# EAGLE design Adafruit Circuit Playground (EAGLE 6.6.0)
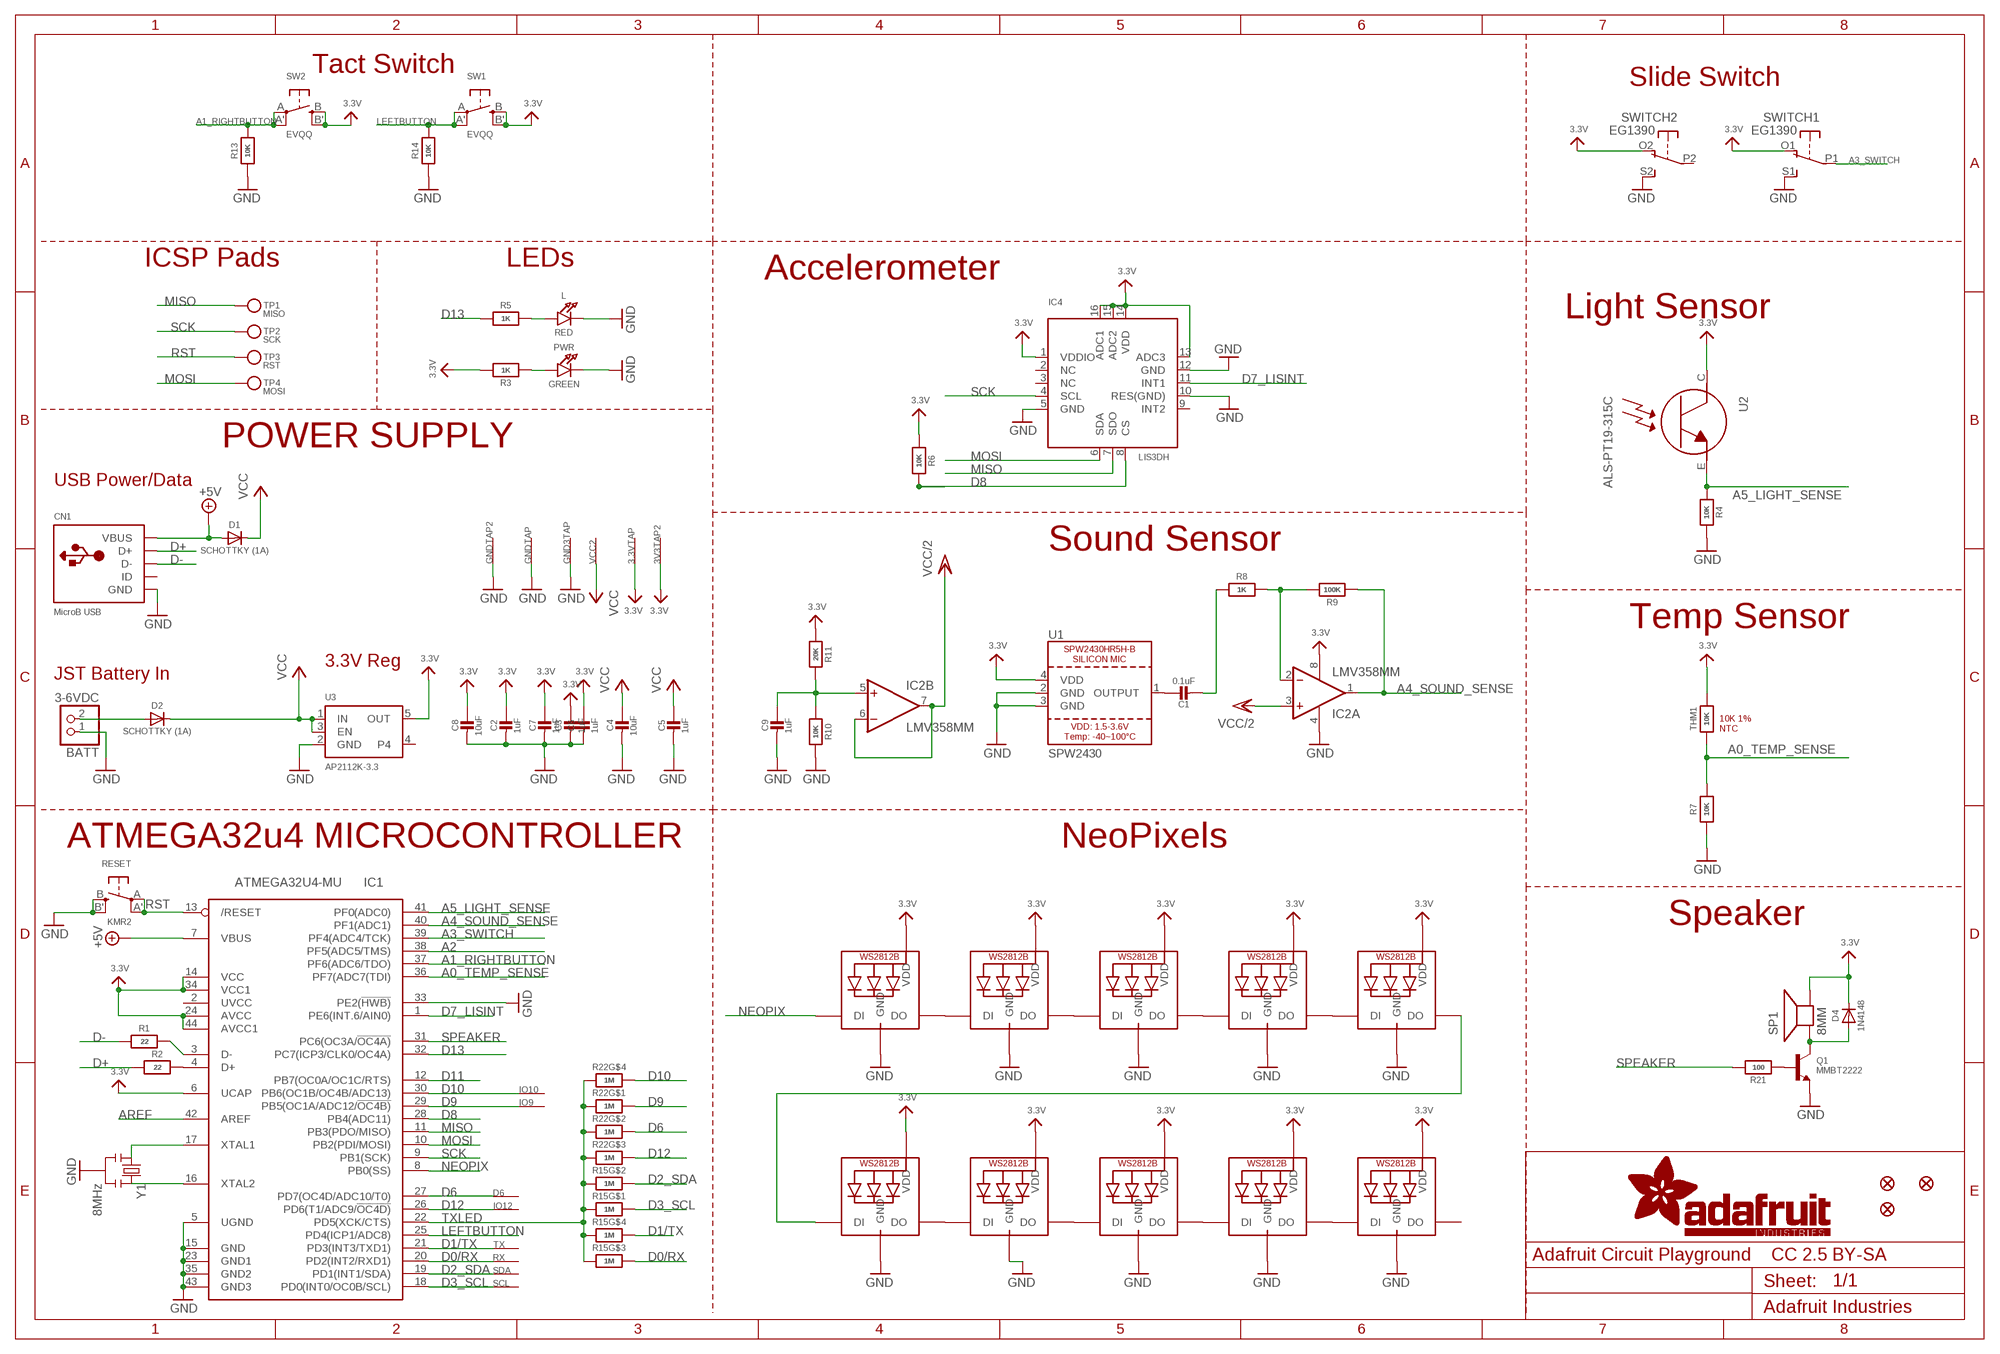
[diagram p0: schematic, sheet 1]

## Parts
3.3VTAP  SEWTAP-ALLIGATOR  [SEWALLI]
3V3TAP2  SEWTAP-ALLIGATOR  [SEWALLI]
BATT  3-6VDC  CON_JST_PH_2PIN  [JSTPH2]
C1  0.1uF  CAP_CERAMIC0603_NO  [0603-NO]
C2  1uF  CAP_CERAMIC0603_NO  [0603-NO]
C3  1uF  CAP_CERAMIC0603_NO  [0603-NO]
C4  10uF  CAP_CERAMIC0805-NOOUTLINE  [0805-NO]
C5  1uF  CAP_CERAMIC0603_NO  [0603-NO]
C6  1uF  CAP_CERAMIC0603_NO  [0603-NO]
C7  1uF  CAP_CERAMIC0603_NO  [0603-NO]
C8  10uF  CAP_CERAMIC0805-NOOUTLINE  [0805-NO]
C9  1uF  CAP_CERAMIC0603_NO  [0603-NO]
CN1  MicroB USB  USB_MICRO_20329_V2  [4UCONN_20329_V2]
D1  SCHOTTKY (1A)  DIODESOD-123  [SOD-123]
D2  SCHOTTKY (1A)  DIODESOD-123  [SOD-123]
D4  1N4148  DIODESOD-323  [SOD-323]
D6  SEWTAP-ALLIGATOR  [SEWALLI]
GND3TAP  SEWTAP-ALLIGATOR  [SEWALLI]
GNDTAP  SEWTAP-ALLIGATOR  [SEWALLI]
GNDTAP2  SEWTAP-ALLIGATOR  [SEWALLI]
IC1  ATMEGA32U4-MU  [TQFN44_7MM]
IC2  LMV358MM  [MSOP08]
IC4  LIS3DH  ACCEL_LIS3DHTR  [LGA16_3X3MM]
IO9  SEWTAP-ALLIGATOR  [SEWALLI]
IO10  SEWTAP-ALLIGATOR  [SEWALLI]
IO12  SEWTAP-ALLIGATOR  [SEWALLI]
L  RED  LED0805_NOOUTLINE  [CHIPLED_0805_NOOUTLINE]
LED1  WS2812B3535  [LED3535]
LED2  WS2812B3535  [LED3535]
LED3  WS2812B3535  [LED3535]
LED4  WS2812B3535  [LED3535]
LED5  WS2812B3535  [LED3535]
LED6  WS2812B3535  [LED3535]
LED7  WS2812B3535  [LED3535]
LED8  WS2812B3535  [LED3535]
LED9  WS2812B3535  [LED3535]
LED10  WS2812B3535  [LED3535]
PWR  GREEN  LED0805_NOOUTLINE  [CHIPLED_0805_NOOUTLINE]
Q1  MMBT2222  TRANSISTOR_NPNWIDE  [SOT23-WIDE]
R1  22  RESISTOR_0603_NOOUT  [0603-NO]
R2  22  RESISTOR_0603_NOOUT  [0603-NO]
R3  1K  RESISTOR_0603_NOOUT  [0603-NO]
R4  10K  RESISTOR_0603_NOOUT  [0603-NO]
R5  1K  RESISTOR_0603_NOOUT  [0603-NO]
R6  10K  RESISTOR_0603_NOOUT  [0603-NO]
R7  10K  RESISTOR_0603_NOOUT  [0603-NO]
R8  1K  RESISTOR_0603_NOOUT  [0603-NO]
R9  100K  RESISTOR_0603_NOOUT  [0603-NO]
R10  10K  RESISTOR_0603_NOOUT  [0603-NO]
R11  20K  RESISTOR_0603_NOOUT  [0603-NO]
R13  10K  RESISTOR_0603_NOOUT  [0603-NO]
R14  10K  RESISTOR_0603_NOOUT  [0603-NO]
R15  1M  RESISTOR_4PACK_NO  [RESPACK_4X0603_NO]
R21  100  RESISTOR_0603_NOOUT  [0603-NO]
R22  1M  RESISTOR_4PACK_NO  [RESPACK_4X0603_NO]
RESET  KMR2  SWITCH_TACT_SMT4.6X2.8  [BTN_KMR2_4.6X2.8]
RX  SEWTAP-ALLIGATOR  [SEWALLI]
SCL  SEWTAP-ALLIGATOR  [SEWALLI]
SDA  SEWTAP-ALLIGATOR  [SEWALLI]
SP1  8MM  SPEAKER_BUZZER5MM  [BUZZER_SMT_5MM]
SW1  EVQQ  SWITCH_TACT_SMT_EVQQ2_SMALL  [EVQ-Q2_SMALLER]
SW2  EVQQ  SWITCH_TACT_SMT_EVQQ2_SMALL  [EVQ-Q2_SMALLER]
SWITCH  EG1390  DPDT-EG1390  [EG1390]
THM1  10K  RESISTOR_0402  [_0402]
TP1  MISO  TESTPOINTROUND1.5MM  [TESTPOINT_ROUND_1.5MM]
TP2  SCK  TESTPOINTROUND1.5MM  [TESTPOINT_ROUND_1.5MM]
TP3  RST  TESTPOINTROUND1.5MM  [TESTPOINT_ROUND_1.5MM]
TP4  MOSI  TESTPOINTROUND1.5MM  [TESTPOINT_ROUND_1.5MM]
TX  SEWTAP-ALLIGATOR  [SEWALLI]
U1  SPW2430  SPW2430HR5H-B  [SPW2430HR5H-B]
U2  ALS-PT19-315C  LIGHT_ALS-PT19-315C  [ALS-PT19-315C]
U3  AP2112K-3.3  VREG_SOT23-5  [SOT23-5]
U$2  FIDUCIAL""  [FIDUCIAL_1MM]
U$3  FIDUCIAL""  [FIDUCIAL_1MM]
U$6  FIDUCIAL""  [FIDUCIAL_1MM]
VCC2  SEWTAP-ALLIGATOR  [SEWALLI]
Y1  8MHz  RESONATORSMD  [RESONATOR-SMD]

## Nets
3.3V: 3.3VTAP.P$1(SEW) 3V3TAP2.P$1(SEW) C2.1 C3.1 C6.1 C7.1 C8.1 D4.C IC1.6(UCAP) IC1.14(VCC) IC1.24(AVCC) IC1.34(VCC1) IC1.44(AVCC1) IC2.8(P:V+) IC4.1(VDDIO) IC4.13(ADC3) IC4.14(VDD) IC4.15(ADC2) IC4.16(ADC1) LED1.2(VDD) LED2.2(VDD) LED3.2(VDD) LED4.2(VDD) LED5.2(VDD) LED6.2(VDD) LED7.2(VDD) LED8.2(VDD) LED9.2(VDD) LED10.2(VDD) R3.2 R6.1 R11.1 SP1.- SW1.B'(S1) SW1.B(S) SW2.B'(S1) SW2.B(S) SWITCH.O1(1:O) SWITCH.O2(2:O) THM1.2 U1.4(VDD) U2.C U3.5(OUT)
+5V: CN1.VBUS D1.A IC1.7(VBUS)
A0_TEMP_SENSE: IC1.36(PF7(ADC7(TDI)) R7.2 THM1.1
A1_RIGHTBUTTON: IC1.37(PF6(ADC6/TDO)) R13.2 SW2.A'(P1) SW2.A(P)
A2: IC1.38(PF5(ADC5/TMS))
A3_SWITCH: IC1.39(PF4(ADC4/TCK)) SWITCH.P1(1:P)
A4_SOUND_SENSE: IC1.40(PF1(ADC1)) IC2.1(A:OUT) R9.1
A5_LIGHT_SENSE: IC1.41(PF0(ADC0)) R4.2 U2.E
AREF: IC1.42(AREF)
D0/RX: IC1.20(PD2(INT2/RXD1)) R15.6 RX.P$1(SEW)
D1/TX: IC1.21(PD3(INT3/TXD1)) R15.5 TX.P$1(SEW)
D2_SDA: IC1.19(PD1(INT1/SDA)) R15.7 SDA.P$1(SEW)
D3_SCL: IC1.18(PD0(INT0/OC0B/SCL)) R15.8 SCL.P$1(SEW)
D6: D6.P$1(SEW) IC1.27(PD7(OC4D/ADC10/T0)) R22.7
D7_LISINT: IC1.1(PE6(INT.6/AIN0)) IC4.11(INT1)
D8: IC1.28(PB4(ADC11)) IC4.8(CS) R6.2
D9: IC1.29(PB5(OC1A/ADC12/!OC4B)) IO9.P$1(SEW) R22.8
D10: IC1.30(PB6(OC1B/OC4B/ADC13)) IO10.P$1(SEW) R22.5
D11: IC1.12(PB7(OC0A/OC1C/RTS))
D12: IC1.26(PD6(T1/ADC9/!OC4D)) IO12.P$1(SEW) R22.6
D13: IC1.32(PC7(ICP3/CLK0/OC4A)) R5.1
D+: CN1.D+ R2.1
D-: CN1.D- R1.1
GND: BATT.1 C2.2 C3.2 C4.2 C5.2 C6.2 C7.2 C8.2 C9.2 CN1.BASE@1(GND) CN1.BASE@2(GND) CN1.GND CN1.SPRT@1(GND) CN1.SPRT@2(GND) CN1.SPRT@3(GND) CN1.SPRT@4(GND) GND3TAP.P$1(SEW) GNDTAP2.P$1(SEW) GNDTAP.P$1(SEW) IC1.5(UGND) IC1.15(GND) IC1.23(GND1) IC1.33(PE2(!HWB)) IC1.35(GND2) IC1.43(GND3) IC2.4(P:V-) IC4.5(GND) IC4.10(RES(GND)) IC4.12(GND) L.C LED1.4(GND) LED2.4(GND) LED3.4(GND) LED4.4(GND) LED5.4(GND) LED6.4(GND) LED7.4(GND) LED8.4(GND) LED9.4(GND) LED10.4(GND) PWR.C Q1.2(E) R4.1 R7.1 R10.2 R13.1 R14.1 RESET.B'(S1) RESET.B(S) SWITCH.S1(1:S) SWITCH.S2(2:S) U1.2(GND) U1.3(GND) U3.2(GND) Y1.2
LEFTBUTTON: IC1.25(PD4(ICP1/ADC8)) R14.2 SW1.A'(P1) SW1.A(P)
MISO: IC1.11(PB3(PDO/MISO)) IC4.7(SDO) TP1.P$1
MOSI: IC1.10(PB2(PDI/MOSI)) IC4.6(SDA) TP4.P$1
N$1: PWR.A R3.1
N$2: IC2.2(A:-IN) R8.2 R9.2
N$3: IC1.3(D-) R1.2
N$4: IC1.4(D+) R2.2
N$6: C9.1 IC2.5(B:+IN) R10.1 R11.2
N$7: BATT.2 D2.A
N$8: IC1.17(XTAL1) Y1.1
N$9: IC1.16(XTAL2) Y1.3
N$10: L.A R5.2
N$11: LED1.1(DI) LED2.3(DO)
N$12: LED1.3(DO) LED3.1(DI)
N$13: LED2.1(DI) LED10.3(DO)
N$14: LED6.3(DO) LED7.1(DI)
N$15: C1.2 R8.1
N$16: LED7.3(DO) LED8.1(DI)
N$17: LED8.3(DO) LED9.1(DI)
N$18: LED9.3(DO) LED10.1(DI)
N$19: LED3.3(DO) LED4.1(DI)
N$20: LED4.3(DO) LED5.1(DI)
N$24: D4.A Q1.3(C) SP1.+
N$25: Q1.1(B) R21.1
NEOPIX: IC1.8(PB0(SS)) LED6.1(DI)
RST: IC1.13(/RESET) RESET.A'(P1) RESET.A(P) TP3.P$1
SCK: IC1.9(PB1(SCK)) IC4.4(SCL) TP2.P$1
SOUNDOUT: C1.1 U1.1(OUTPUT)
SPEAKER: IC1.31(PC6(OC3A/!OC4A)) R21.2
TXLED: IC1.22(PD5(XCK/CTS)) R15.1 R15.2 R15.3 R15.4 R22.1 R22.2 R22.3 R22.4
VCC: C4.1 C5.1 D1.C D2.C U3.1(IN) U3.3(EN) VCC2.P$1(SEW)
VCC/2: IC2.3(A:+IN) IC2.6(B:-IN) IC2.7(B:OUT)
Unconnected: CN1.ID IC1.2(UVCC) IC4.2(NC) IC4.3(NC) IC4.9(INT2) LED5.3(DO) SWITCH.P2(2:P) U3.4

## Notes on the sheet
- Tact Switch
- Slide Switch
- ICSP Pads | LEDs
- Accelerometer
- Light Sensor
- POWER SUPPLY
- USB Power/Data
- Sound Sensor
- Temp Sensor
- 3.3V Reg
- JST Battery In
- 10K 1%
  NTC
- ATMEGA32u4 MICROCONTROLLER | NeoPixels
- Speaker
- CC 2.5 BY-SA

## Library data of the parts
3.3VTAP 3V3TAP2 D6 GND3TAP GNDTAP GNDTAP2 IO9 IO10 IO12 RX SCL SDA TX VCC2 = microbuilder:SEWTAP
BATT = microbuilder:CON_JST_PH_2PIN: JST 2-Pin Right-Angle Connector PH-Series - 4UConnector: 17311 SH-Series - 4UConnector: 07278
C1-C9 = microbuilder:CAP_CERAMIC: Ceramic Capacitors For new designs, use the packages preceded by an '_' character since they are more reliable: The following footprints should be used on most boards: _0402 - Standard footprint for regular board layouts _0603 - Standard footprint for regular board layouts _0805 - Standard footprint for regular board layouts _1206 - Standard footprint for regular board layouts For extremely tight-pitch boards where space is at a premium, the following 'micro-pitch' footprints can be used (smaller pads, no silkscreen outline, etc.): _0402MP - Micro-pitch footprint for very dense/compact boards _0603MP - Micro-pitch footprint for very dense/compact boards _0805MP - Micro-pitch footprint for very dense/compact boards _1206MP - Micro-pitch footprint for very dense/compact boards
CN1 = microbuilder:USB: USB Connectors USBMINIB - Surface Mount Female Mini-B USB Connector 4UConnector: 06564
D1 D2 D4 = microbuilder:DIODE: Diode SMA Model Volts Amps Type Vf Ir Digikey # Notes SSA34-E3 40V 3A Schottky 480mV @ 3A 200uA @ 40V SSA34-E3/61TGITR-ND CDBA120-G 20V 1A Schottky 500mV @ 1A 500uA @ 20V 641-1014-6-ND REEL MBRA210 10V 2A Schottky 350mV @ 2A 700uA @ 10V MBRA210LT3 SOD-123 Model Volts Amps Type Vf Ir Order # Notes BAT54T1G 30V 200mA Schottky 800mV @ 200mA 2uA @ 25V BAT54T1GOSTR-ND B0530W 30V 500mA Schottky 430mV @ 500mA 130uA @ 30V B0530W-FDICT-ND REEL MBR120 20V 1A Schottky 340mV @ 1A MBR120VLSFT1GOSCT-ND SOD-323 Model Volts Amps Type Vf Ir Order # Notes PMEG2005EJ 20V 500mA Schottky 355mV @ 500mA 568-4110-1-ND ZLLS410 10V 570mA Schottky 380mV @ 570mA ZLLS410CT-ND 1N4148WS 75V 150mA Silicon/Simple 1V 1N4148WSFSCT-ND REEL SOD-523 Model Volts Amps Type Vf Ir Order # Notes BAT54XV2 30V 200mA Schottky 0.8V @ 100mA BAT54XV2CT-ND TB751S 30V 30mA Schottky RB751S-40TE61CT-ND SOT23-R/W (R = Solder Paste/Reflow Ovens, W = Hand-Soldering) Model Volts Amps Type Vf Ir Order # Notes BAT54FILM 40V 300mA Schottky 497-7162-1-ND POWERDI-5 Model Volts Amps Type Vf Ir Order # Notes PDS560 60V 5A Schottky 670mV @ 5A 150uA @ 60V PDS560DICT-ND
IC1 = microbuilder:ATMEGA32U4: http://www.ladyada.net/library/eagle
IC2 = linear:LMV358?*: Dual General Purpose, Low Voltage, Rail-to-Rail Output Operational Amplifiers Source: http://www.national.com/mpf/LM/LMV321.html http://www.national.com/dt/lmv_qual.pdf
IC4 = microbuilder:ACCEL_LIS3DHTR: LIS3DHTR 3-Axis Accelerometer with I2C/SPI Interface VDD: 1.71-3.6V VDDIO: 1.71-VDD+0.1V Scale: +/-2g, 4g, 8g, 16g with 16--bit data output Temp:: -40°C - 85°C Mouser: 511-LIS3DHTR Digikey: 497-10613-1-ND
L PWR = microbuilder:LED: LED 0603 - 0603 Surface Mount Package 2mA: Green LED - Low Power (3.9mcd, 2ma, 1.7Vf) - Digikey: 475-2709-2-ND Orange LED - Low Power (9.8mcd, 2ma, 1.8Vf) - Digikey: 475-1194-2-ND Red LED - Low Power (5mcd, 2ma, 1.8Vf) - Digikey: 475-1195-2-ND Yellow LED - Low Power (7mcd, 2ma, 1.8Vf) - Digikey: 475-1196-2-ND 5mA: Blue LED - Low Power (17mcd, 5ma, 2.9Vf) - Digikey: LNJ937W8CRACT-ND 0805 - 0805 Surface Mount Package 2mA: Red LED (8.8mcd, 2mA, 1.8Vf, Clear) - Low Power [Digikey: 475-2510-1-ND] Green LED (5mcd, 2mA, 1.8Vf, Clear) - Low Power [Digikey: 475-2730-1-ND] Yellow LED (11.3mcd, 2mA, 1.8Vf, Clear) - Low Power [Digikey: 475-2555-1-ND] 20mA: Red LED (104mcd, 20mA, Diffused) - LS R976 [Digikey: 475-1278-6-ND] Red LED (12mcd, 20mA, 2.0Vf, Clear) - APT2012EC [Digikey: 754-1128-1-ND] Green LED (15mcd, 20mA, 2.2Vf, Clear) - APT2012GC [Digikey: 754-1131-1-ND] Orange LED (160mcd, 20mA, 2.1Vf, Clear) - APT2012SECK [Digikey: 754-1130-1-ND] 1206 - 1206 Surface Mount Package Green LED (26mcd, 20mA, Diffused) - LG N971 [Digikey: 475-1407-6-ND] Red LED (15mcd, 20mA, Diffused) - LH N974 [Digikey: 475-1416-6-ND] Cree - Cree High-Power Surface Mount LEDs XPEBWT-L1-0000-00D50 - White 111lm 350mA 2.9Vf 6200K 110° XTEAWT-00-0000-00000LEE3 - White 114lm 350mA 2.85Vf 5000K 115° Everlight - Everlight 45-21 Series Surface Mount LEDs 45-21/QK2C-B2832AC2CB2/2T - Warm White 2000mcd 20mA 3.25Vf 3050K 120° 45-21/LK2C-B38452C4CB2/2T - Nuetral White 2000mcd 20mA 3.25Vf 4150K 120° 45-21/LK2C-B50634C6CB2/2T - Cold White 2200mcd 20mA 3.25Vf 5650K 120° PLCC2 Reverse Mount LS T77K-J1L2-1-0-2-R18-Z - Red 11.25mcd 2mA 1.8Vf 630nm 120° LO T77K-L1M2-24-Z - Orange 19.6mcd 2mA 1.8Vf 606nm 120° LY T77K-K2M1-26-Z - Yellow 15.7mcd 2mA 1.8Vf 587nm 120°
LED1-LED10 = microbuilder:WS2812B
Q1 = microbuilder:TRANSISTOR_NPN: NPN Transistor Transistor (NPN) 500mA 45V - BC817 [Digikey: 568-1631-1-ND] Transistor (NPN) 500mA 45V - BC817,215 [Mouser: 771-BC817-T/R] SOT23-R - SOT23 footprint optimised for use with solder paste and reflow ovens. SOT23-W - SOT23 footprint optimised for hand-soldering (larger pads).
R1-R11 R13 R14 R21 THM1 = microbuilder:RESISTOR: Resistors For new designs, use the packages preceded by an '_' character since they are more reliable: The following footprints should be used on most boards: _0402 - Standard footprint for regular board layouts _0603 - Standard footprint for regular board layouts _0805 - Standard footprint for regular board layouts _1206 - Standard footprint for regular board layouts For extremely tight-pitch boards where space is at a premium, the following 'micro-pitch' footprints can be used (smaller pads, no silkscreen outline, etc.): _0402MP - Micro-pitch footprint for very dense/compact boards _0603MP - Micro-pitch footprint for very dense/compact boards _0805MP - Micro-pitch footprint for very dense/compact boards _1206MP - Micro-pitch footprint for very dense/compact boards
R15 R22 = microbuilder:RESISTOR_4PACK: Resistor Packs (4 resistors) 4 x 0603 10K 1/16W - Digikey: YC164J-10KCT-ND
RESET SW1 SW2 = microbuilder:SWITCH_TACT_SMT: SMT Tact Switches 6x6mm - Digikey: P12940SCT-ND KMR2 (4.6x2.8mm) - Digikey: 401-1426-1-ND EVQ-PQHB55 - Light Touch, 160GF (4.5x4.5mm) - Digikey: P8090SCT-ND KMT0 - KMT021 NGJ LHS (etc.) IP68/Waterproof - Digikey: CKN10289CT-ND
SP1 = microbuilder:SPEAKER: SPEAKER Source: Buerklin Added PS12 (for part # PS1240 piezo) http://www.ladyada.net/library/pcb/eaglelibrary.html
SWITCH = adafruit:DPDT
TP1-TP4 = microbuilder:TESTPOINT: Test Point Various test points for characterisation and PCB testing TESTPOINT_SMT - Compact Surface Mount Test Point [Digikey: 5016KTR-ND]
U1 = microbuilder:SPW2430HR5H-B: SPW2430HR5H-B - Silicon Microphone
U2 = microbuilder:LIGHT_ALS-PT19-315C: ALS-PT19-315C - Analog Light Sensor VCC: 2.5-5.5V
U3 = microbuilder:VREG_SOT23-5: SOT23-5 Fixed Voltage Regulators Part Current Out V Out V In V Dropout θJA (°C/W) TJ (°C) Digikey Part No. ADP121 150mA 3.3V 3.4-5.5V 0.09V @ 150mA -- -- ADP121-AUJZ33R7CT-ND ADP121 150mA 3.0V 3.1-5.5V 0.09V @ 150mA -- -- ADP121-AUJZ30R7CT-ND ADP122 300mA 3.3V 3.4-5.5V 0.085V @ 300mA -- -- ADP122AUJZ-3.3-R7CT-ND ADP1712 300mA 3.3V 3.5-5.5V 0.17V @ 300mA -- -- ADP1712AUJZ-3.3-R7TR-ND AP7311 (Low Cost) 150mA 3.3V 3.5-6V 0.15V @ 150mA -- -- AP7311-33WG-7DICT-ND LD39015M18R 150mA 1.8V 1.9V-5.5V 0.08V @ 100mA -- -- 497-6977-1-ND LP2985A-33DBVR 150mA 3.3V 3.3-16V 0.28V @ 150mA 206 150 296-18479-1-ND MCP1824T-3302E/OT 300mA 3.3V 3.5V-6V 0.2V @ 300mA -- -- MCP1824T-3302E/OTCT-ND MIC5205-2.5YM5 TR 150mA 2.5V 2.7-16V 0.165V @ 150mA -- -- 576-1257-2-ND MIC5205-3.0YM5 TR 150mA 3.0V 3.2V-16V 0.165V @ 150mA -- -- 576-1258-2-ND MIC5205-3.3YM5 TR 150mA 3.3V 3.5V-16V 0.165V @ 150mA -- -- 576-1259-2-ND TPS780330220 150mA 3.3V+2.2V 3.6-5.5V 250mV Max -- -- 296-23332-1-ND TDA3663/N1,135 100mA 3.3V 3.5-45V 0.18V @ 50mA -- -- 568-5343-1-ND Max operating temp can be calculated using θJA, TJ (max junction temperature), and power in watts. Set the "Maximum Ambient Temperature" until it reaches TJ ("Max Junction Temperature"), which is the absolute limit for safe use of the regulator: Heat Sink Temperature Calculator <http://www.daycounter.com/Calculators/Heat-Sink-Temperature-Calculator.phtml> For example, With 12V source into a 3.3V LP2985 and a 30mA load, we are dissipating (12V-3.3V) * 0.03A = 0.261W. With a θJA of 206 °C/W, a TJ of 150°C, and 261mW we can safely use the chip without a heat sink up to 75°C (=147.1°C Junction Temperature).
U$2 U$3 U$6 = microbuilder:FIDUCIAL: Fiducial Alignment Points Various fiducial points for machine vision alignment.; BOM: EXCLUDE
Y1 = SparkFun:RESONATOR: Resonator Small SMD resonator. This is the itty bitty 10/20MHz resonators with built in caps. CSTCE10M0G55 and CSTCE20M0V53. Footprint has been reviewed closely but hasn't been tested yet.

## Board
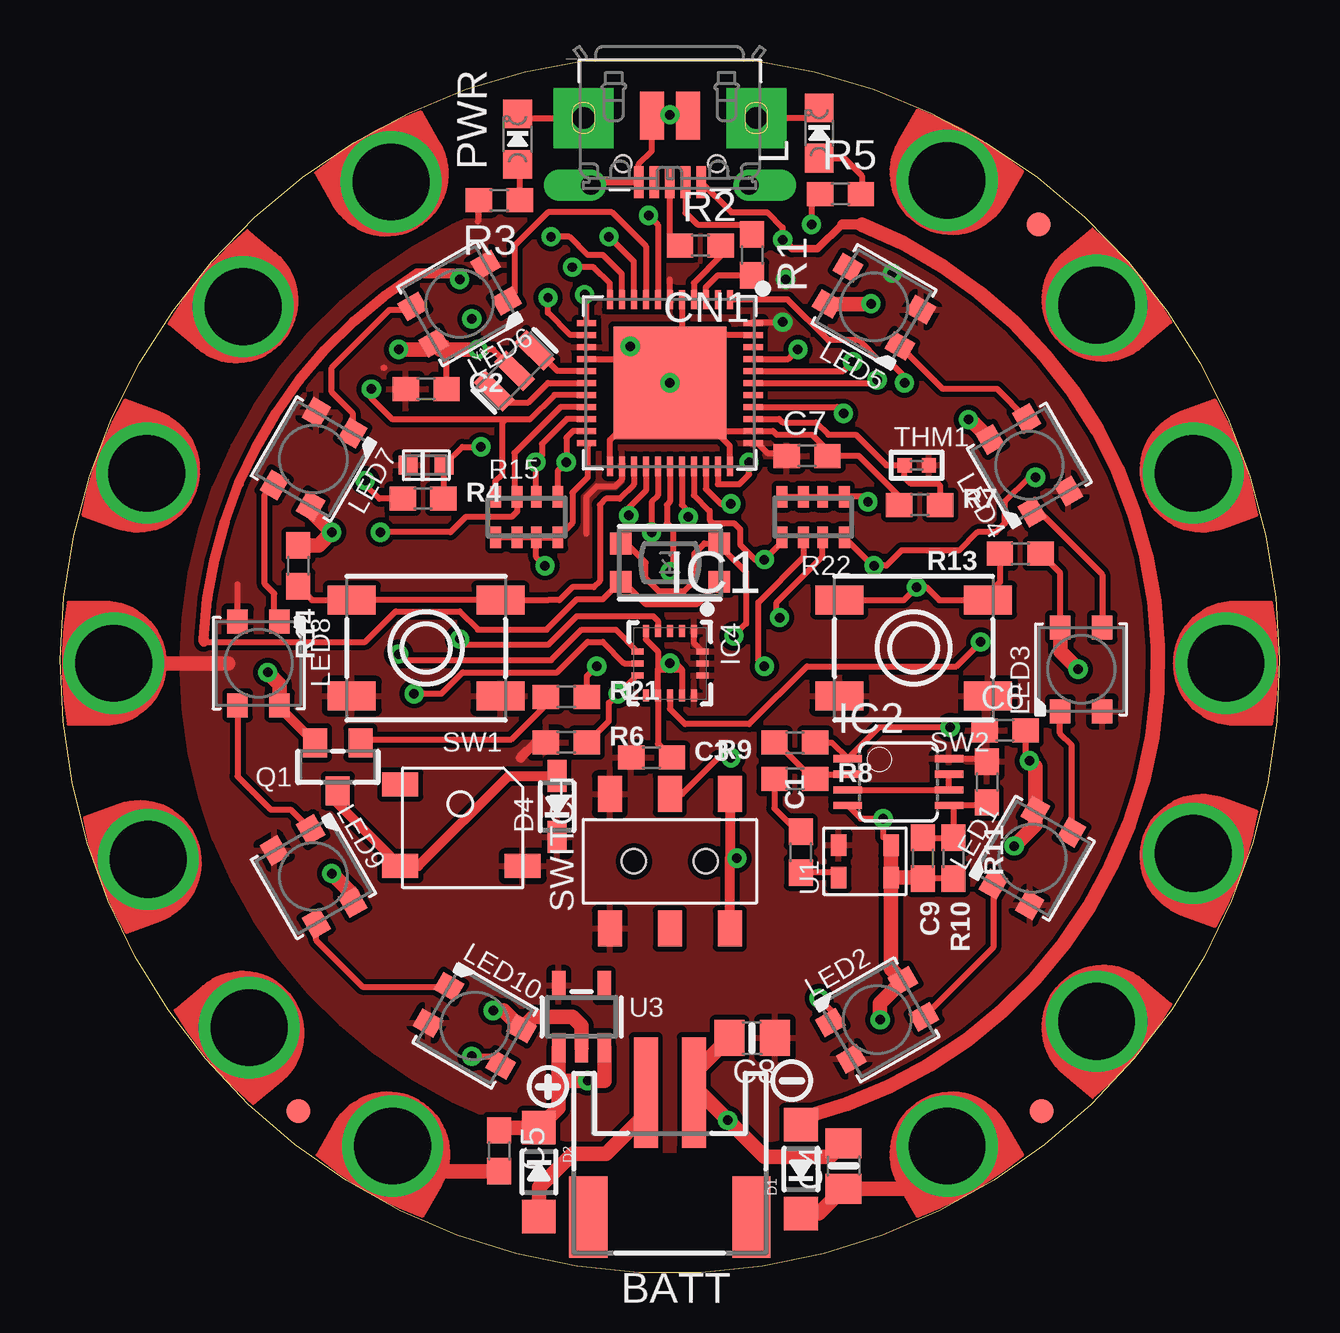
[diagram p1: board, top side]
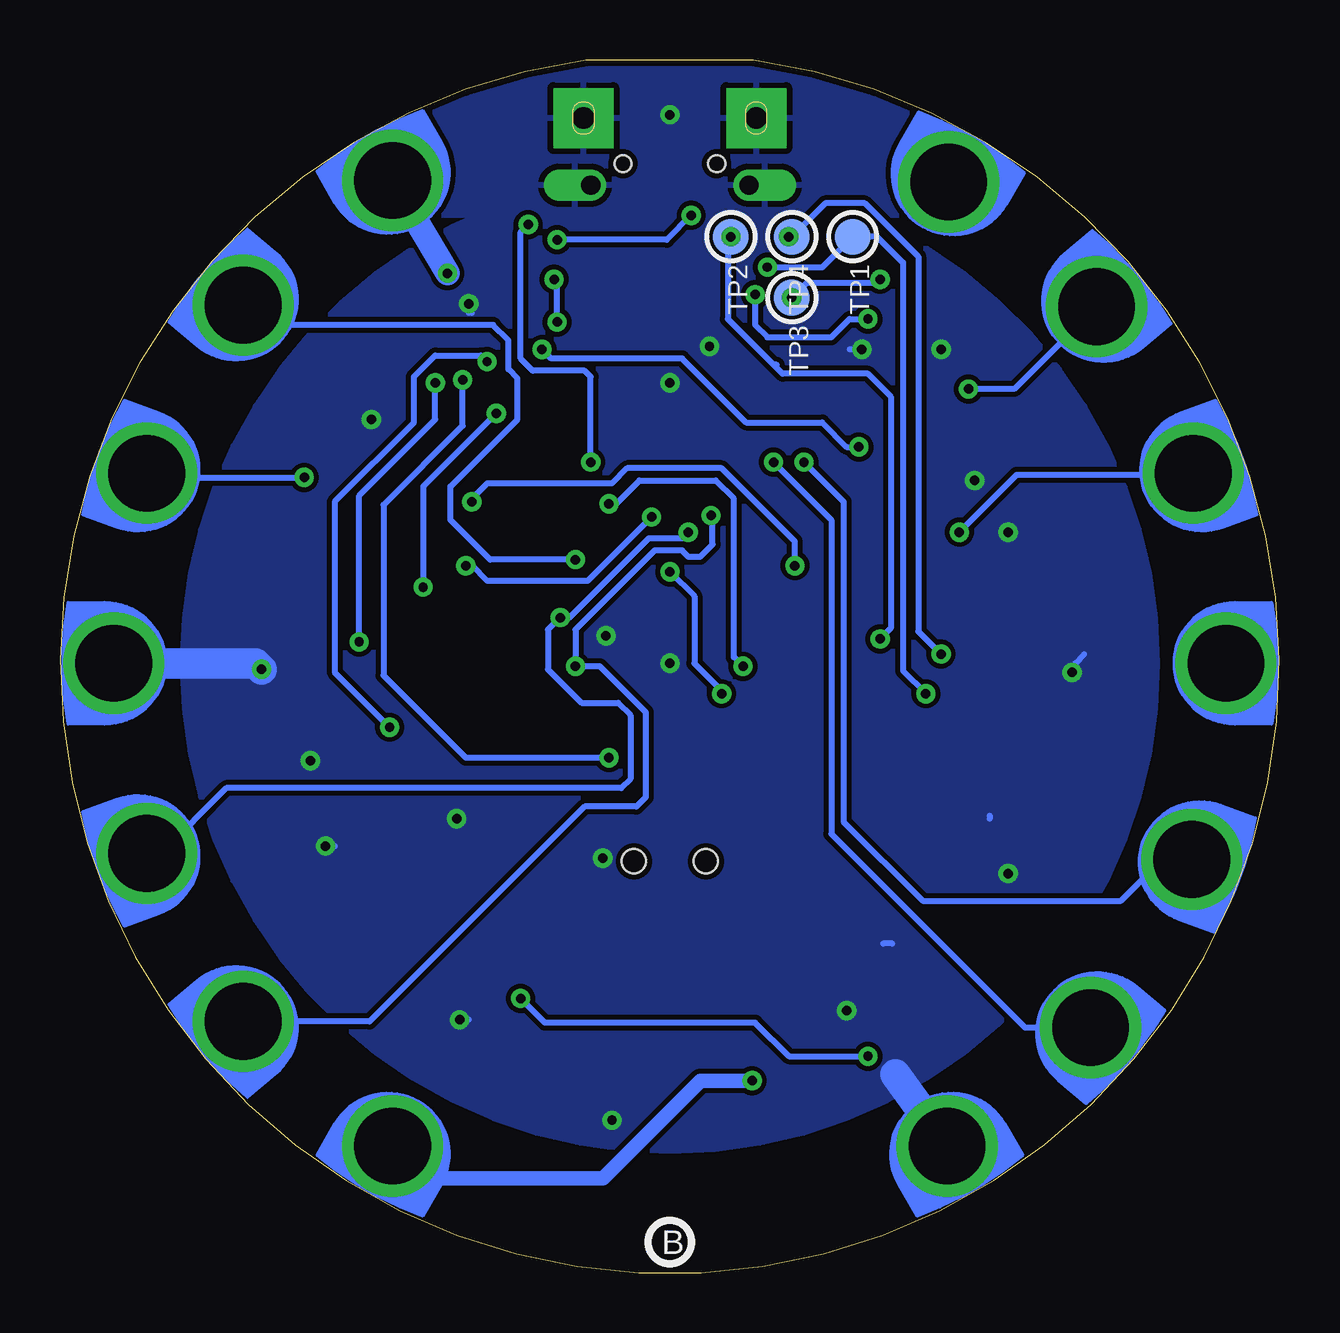
[diagram p2: board, bottom side, seen from below]

Size 50.82 x 50.55 mm. Coordinates in mm from the lower left corner, seen from the top.
Outline: 21.92,50.55 28.9,50.55 arc-344 21.92,50.55
Copper layers (1*16): Top 0.035mm / dielectric 1.5mm / Bottom 0.035mm
Design rules "adafruit *": minimum track width 8mil, minimum drill 15.5mil, track to track 8mil, track to pad 8mil, pad to pad 8mil, via to via 8mil, smd to smd 8mil, copper to edge 10mil, drill to drill 8mil, minimum pad ring 10mil, minimum via ring 8mil, stop-mask expansion 2mil, vias tented up to drill 20mil, thermal gap 10mil

### Footprints (pad centres in the part's own frame; a part is rotated, then mirrored left to right if it is on the bottom)
SEWALLI = drill 3.2: P$1 0,0.508
JSTPH2 = smd 1 x 4.6: 1 -1,-3.7; 2 1,-3.7 | smd 1.6 x 3.4: NC1 -3.4,1.5; NC2 3.4,1.5
0603-NO = smd 1.1 x 1: 1 -0.85,0; 2 0.85,0
0805-NO = smd 1.24 x 1.5: 1 -0.95,0; 2 0.95,0
4UCONN_20329_V2 = smd 1 x 2: BASE@1 -0.75,-2; BASE@2 0.75,-2 | smd 0.4 x 1.35: D+ 0,0.775; D- -0.65,0.775; GND 1.3,0.775; ID 0.65,0.775; VBUS -1.3,0.775 | drill 0.8 pad 1.2 offset: SPRT@1 -3.3,0.9; SPRT@2 3.3,0.9 | drill 0.9 pad 2.5 square: SPRT@3 -3.6,-1.9; SPRT@4 3.6,-1.9 | hole 0.7: -1.95,0; 1.95,0
SOD-123 = smd 1.4 x 1.4: A 1.85,0; C -1.85,0
SOD-323 = smd 1.35 x 0.8: A 1.27,0; C -1.27,0
TQFN44_7MM = smd 0.25 x 0.8: 1 -2.5,-3.475; 2 -2,-3.475; 3 -1.5,-3.475; 4 -1,-3.475; 5 -0.5,-3.475; 6 0,-3.475; 7 0.5,-3.475; 8 1,-3.475; 9 1.5,-3.475; 10 2,-3.475; 11 2.5,-3.475; 23 2.5,3.475; 24 2,3.475; 25 1.5,3.475; 26 1,3.475; 27 0.5,3.475; 28 0,3.475; 29 -0.5,3.475; 30 -1,3.475; 31 -1.5,3.475; 32 -2,3.475; 33 -2.5,3.475 | smd 0.8 x 0.25: 12 3.475,-2.5; 13 3.475,-2; 14 3.475,-1.5; 15 3.475,-1; 16 3.475,-0.5; 17 3.475,0; 18 3.475,0.5; 19 3.475,1; 20 3.475,1.5; 21 3.475,2; 22 3.475,2.5; 34 -3.475,2.5; 35 -3.475,2; 36 -3.475,1.5; 37 -3.475,1; 38 -3.475,0.5; 39 -3.475,0; 40 -3.475,-0.5; 41 -3.475,-1; 42 -3.475,-1.5; 43 -3.475,-2; 44 -3.475,-2.5 | smd 4.7 x 4.7: THERMAL 0,0
MSOP08 = smd 0.3 x 1.2: 1 -0.976,-2.113; 2 -0.326,-2.113; 3 0.324,-2.113; 4 0.974,-2.113; 5 0.974,2.112; 6 0.324,2.112; 7 -0.326,2.112; 8 -0.976,2.112
LGA16_3X3MM = smd 0.5 x 0.25: 1 -1.35,1; 2 -1.35,0.5; 3 -1.35,0; 4 -1.35,-0.5; 5 -1.35,-1; 9 1.35,-1; 10 1.35,-0.5; 11 1.35,0; 12 1.35,0.5; 13 1.35,1 | smd 0.25 x 0.5: 6 -0.5,-1.35; 7 0,-1.35; 8 0.5,-1.35; 14 0.5,1.35; 15 0,1.35; 16 -0.5,1.35
CHIPLED_0805_NOOUTLINE = smd 1.2 x 1.2: A 0,-1.05; C 0,1.05
LED3535 = smd 1 x 0.85: 1 -1.75,0.875; 2 -1.75,-0.875; 3 1.75,-0.875; 4 1.75,0.875
SOT23-WIDE = smd 1 x 1.2: 1 -0.95,-1; 2 0.95,-1; 3 0,1
RESPACK_4X0603_NO = smd 0.45 x 0.9: 1 -1.3,-0.85; 2 -0.4,-0.85; 3 0.4,-0.85; 4 1.3,-0.85; 5 1.3,0.85; 6 0.4,0.85; 7 -0.4,0.85; 8 -1.3,0.85
BTN_KMR2_4.6X2.8 = smd 0.9 x 0.9: A 2.05,0.8; A' -2.05,0.8; B 2.05,-0.8; B' -2.05,-0.8
BUZZER_SMT_5MM = smd 1.5 x 1: + -2.6,-1.6; - 2.5,-1.6; MT -2.6,1.8
EVQ-Q2_SMALLER = smd 2 x 1.2: A -3.1,-2; A' 3.1,-2; B -3.1,2; B' 3.1,2
EG1390 = smd 1 x 1.5: O1 -2.5,2.8; O2 -2.5,-2.8; P1 0,2.8; P2 0,-2.8; S1 2.5,2.8; S2 2.5,-2.8 | hole 1: 1.5,0; -1.5,0
_0402 = smd 0.6 x 0.6: 1 -0.508,0; 2 0.508,0
TESTPOINT_ROUND_1.5MM = smd 1.5 x 1.5: P$1 0,0
SPW2430HR5H-B = smd 0.9 x 0.66: 1 -0.675,1.095; 2 -0.675,-1.095; 3 0.675,-1.095; 4 0.675,1.095
ALS-PT19-315C = smd 0.8 x 0.8: C -0.75,0; E 0.75,0
SOT23-5 = smd 0.55 x 1.2: 1 -0.95,-1.3; 2 0,-1.3; 3 0.95,-1.3; 4 0.95,1.3; 5 -0.95,1.3
FIDUCIAL_1MM = smd 1 x 1: 1 0,0
RESONATOR-SMD = smd 0.7 x 1.7: 1 -1.2,0; 2 0,0; 3 1.2,0

### Placement (x,y rotation side)
3.3VTAP  2.74,25.4 90 top
3V3TAP2  36.71,45.09 330 top
BATT  25.41,3.81 180 top
C1  30.87,17.53 90 top
C2  15.25,36.83 0 top
C3  24.65,21.46 0 top
C4  32.65,4.45 90 top
C5  18.3,5.08 270 top
C6  39.38,22.61 0 top
C7  31.12,34.04 0 top
C8  28.84,9.78 180 top
C9  35.95,17.27 270 top
CN1  25.41,46.23 180 top
D1  30.87,4.32 90 top
D2  19.95,4.19 270 top
D4  20.71,19.43 90 top
D6  46.75,17.65 250 top
GND3TAP  14.04,45.02 30 top
GNDTAP  48.08,25.4 270 top
GNDTAP2  14.11,5.72 150 top
IC1  25.41,37.08 180 top
IC2  34.93,20.45 270 top
IC4  25.41,25.4 270 top
IO9  46.75,33.15 290 top
IO10  42.81,40.01 310 top
IO12  42.81,10.8 230 top
L  31.63,47.5 0 top
LED1  40.52,17.27 60 top
LED2  34.05,10.54 30 top
LED3  42.55,25.15 90 top
LED4  40.4,33.66 120 top
LED5  33.92,40.26 150 top
LED6  16.65,40.39 210 top
LED7  10.55,33.91 240 top
LED8  8.26,25.4 270 top
LED9  10.55,16.51 300 top
LED10  17.28,10.29 330 top
PWR  19.06,47.24 0 top
Q1  11.57,21.08 180 top
R1  28.84,42.42 270 top
R2  26.68,42.8 0 top
R3  18.3,44.7 180 top
R4  15.12,32.26 0 top
R5  32.52,44.96 0 top
R6  21.09,22.1 0 top
R7  35.82,32 0 top
R8  30.62,20.57 0 top
R9  30.62,22.1 180 top
R10  37.22,17.27 270 top
R11  38.62,20.45 270 top
R13  40.01,29.97 180 top
R14  9.92,29.46 270 top
R15  19.44,31.5 0 top
R21  21.09,24 0 top
R22  31.38,31.5 180 top
RESET  25.41,29.59 180 top
RX  4.14,17.4 110 top
SCL  8.01,39.94 50 top
SDA  4.07,33.15 70 top
SP1  16.77,18.54 0 top
SW1  15.25,26.04 180 top
SW2  35.57,26.04 180 top
SWITCH  25.41,17.15 0 top
THM1  35.7,33.66 0 top
TP1  17.79,43.18 270 bottom
TP2  22.87,43.18 270 bottom
TP3  20.33,40.64 270 bottom
TP4  20.33,43.18 270 bottom
TX  8.26,10.54 130 top
U1  33.54,17.15 90 top
U2  15.25,33.66 0 top
U3  21.73,10.67 0 top
U$1  [SYMBOL_MINUS]  30.49,8 0 top
U$2  40.78,43.69 0 top
U$3  9.92,6.73 0 top
U$4  [FLORAMED]  37.09,27.31 0 bottom
U$6  40.9,6.73 0 top
U$7  [PCBFEAT-REV-040]  25.41,1.27 0 bottom
U$34  [CPLAYFRONT]  0.01,0 0 top
U$35  [SYMBOL_PLUS]  20.33,7.75 0 top
U$46  [CPLAYBACK]  50.81,0 0 bottom
VCC2  36.71,5.72 210 top
Y1  18.93,37.59 45 top

### Tracks (layer width: path | path; a pad name or v marks a point on that pad's centre or on a via)
3.3V  (via drill 0.39)
  Top 0.254: R3.2 arc90 17.41,44.67 17.41,43.82 | IC1.6 25.41,41.4 | IC1.34 29.05,34.58 29.47,34.16 30.4,34.16 C7.1 | IC1.24 23.41,33.05 23.12,32.77 22.36,32.77 21.92,32.32 21.92,30.8 | LED8.2 7.39,28.69 7.38,28.7 | IC4.16 26.41,26.25 IC4.1 | IC1.44 28.92,39.62 v30.11,39.62 | 13.51,37.72 13.47,37.72 | IC2.8 38.62,21.42 R11.1
  Top 0.406: R6.1 19.82,22.1 19.19,21.46
  Top 0.61: 3.3VTAP.P$1 6.99,25.4
  Bottom 0.254: v30.11,39.62 30.11,41.4 v30.24,41.4
  Bottom 1.016: 3V3TAP2.P$1 v34.68,41.66
  pour Top: 25.41,5.08 arc-90 5.09,25.4 arc-90 25.41,45.72 arc-90 45.73,25.4 arc-90
+5V  (via drill 0.39)
  Top 0.254: v24.52,44.07 24.91,43.68 IC1.7 | CN1.VBUS 27.97,44.2 29.47,44.2 30.11,43.56 v30.11,43.05 | 30.87,6.22 D1.A
  Top 0.305: 32.59,43.69 31.57,42.67 30.49,42.67 v30.11,43.05
  Top 0.406: 33.41,43.69 32.59,43.69
  Top 0.61: 33.41,43.69 arc-144 31,6.48 30.87,6.35 D1.A
  Bottom 0.254: v24.52,44.07 25.54,43.05 v30.11,43.05
A0_TEMP_SENSE
  Top 0.254: IC1.36 29.96,35.58 30.11,35.43 31.51,35.43 32.01,34.93 33.16,34.93 34.43,33.66 THM1.1 35.19,33.15 35.44,32.89 36.59,32.89 36.67,32.81 R7.2
A1_RIGHTBUTTON  (via drill 0.39)
  Top 0.254: IC1.37 32.38,36.08 v32.65,35.81 | SW2.A' 35.16,28.04 v35.7,28.58 36.1,28.58 36.64,28.04 SW2.A 38.67,28.29 39.16,28.78 R13.2
  Bottom 0.254: v32.65,35.81 35.7,32.77 v35.7,28.58
A3_SWITCH  (via drill 0.39)
  Top 0.254: IC1.39 34.05,37.08 v34.05,37.21 | v27.95,21.46 27.44,21.46 25.92,19.95 SWITCH.P1
  Bottom 0.254: v27.95,21.46 33.92,21.46 37.35,24.89 37.35,32 34.05,35.31 v34.05,37.21
A4_SOUND_SENSE  (via drill 0.39)
  Top 0.254: IC1.40 32.64,37.58 v33.03,37.97 | IC2.1 32.4,21.42 | v37.09,22.73 34.13,22.73 IC2.1 | R9.1 32.15,22.1 IC2.1
  Bottom 0.254: v33.03,37.97 33.28,38.23 35.19,38.23 36.08,37.34 36.08,36.07 36.08,35.94 36.08,35.43 39.38,32.13 39.38,25.02 v37.09,22.73
A5_LIGHT_SENSE  (via drill 0.39)
  Top 0.254: IC1.41 30.35,38.08 v30.74,38.48 | R4.2 16,32.29 U2.E 16.76,34.42 v17.54,34.42
  Bottom 0.254: v17.54,34.42 18.04,34.42 19.06,35.43 22.23,35.43 24.9,38.1 30.36,38.1 v30.74,38.48
D0/RX  (via drill 0.39)
  Top 0.254: IC1.20 21.12,35.58 20.08,34.54 20.08,34.04 v19.82,33.78 19.84,33.76 R15.6
  Bottom 0.254: v19.82,33.78 18.17,32.13 18.17,18.8 14.87,15.49 6.61,15.49 4.88,17.23 RX.P$1
D1/TX  (via drill 0.39)
  Top 0.254: IC1.21 21.38,35.08 21.09,34.8 v21.09,33.78 20.74,33.43 R15.5
  Bottom 0.254: TX.P$1 10.6,10.21 18.68,18.29 18.68,31.37 v21.09,33.78
D2_SDA  (via drill 0.39)
  Top 0.254: IC1.19 20.85,36.08 18.93,34.16 18.93,32.45 R15.7 19.04,31.73 18.81,31.5 16.9,31.5 16.27,30.86 v13.34,30.86
  Bottom 0.254: v13.34,30.86 10.95,33.26 3.66,33.26 SDA.P$1
D3_SCL  (via drill 0.39)
  Top 0.254: IC1.18 20.59,36.58 19.57,35.56 18.55,35.56 | R15.8 18.14,32.99 18.42,33.27 18.42,35.43 18.55,35.56 | 18.55,35.56 13.85,35.56 12.96,36.45 v12.96,36.83
  Bottom 0.254: SCL.P$1 11.06,36.83 v12.96,36.83
D6  (via drill 0.39)
  Top 0.254: IC1.27 24.91,32.39 24.65,32.13 v24.65,30.86 | v29.98,27.31 29.85,27.43 29.85,27.94 31.76,29.85 31.76,30.63 R22.7
  Bottom 0.254: v24.65,30.86 24.9,30.61 26.3,30.61 29.6,27.31 v29.98,27.31 30.49,26.8 30.49,25.15 29.09,23.75 27.57,23.75 27.06,23.24 27.06,20.57 27.44,20.19 43.9,20.19 46.62,17.48 D6.P$1
D7_LISINT  (via drill 0.39)
  Top 0.254: IC4.11 25.41,23.5 26.04,22.86 28.71,22.86 31.12,25.27 37.35,25.27 v38.36,26.29 | v35.19,37.08 35.19,37.34 34.55,37.97 34.17,37.97 33.28,38.86 32.01,38.86 30.32,40.56 IC1.1
  Bottom 0.254: v38.36,26.29 38.36,32.39 35.19,35.56 v35.19,37.08
D8  (via drill 0.39)
  Top 0.254: IC1.28 25.41,32.13 25.28,32 25.28,31.24 25.54,30.99 25.54,29.34 v25.41,29.21 | R6.2 21.98,22.1 22.87,22.99 22.87,23.75 v23.25,24.13 24.02,24.9 IC4.8
  Bottom 0.254: v25.41,29.21 24.39,28.19 24.39,25.4 23.25,24.26 v23.25,24.13
D9  (via drill 0.39)
  Top 0.254: IC1.29 25.91,32.01 26.17,31.75 v26.17,31.5 | 45.98,33.78 46.83,32.93 IO9.P$1 46.89,33.66 | R22.8 33.86,29.46 v33.92,29.46 34.43,29.46 35.06,30.1 37.47,30.1 38.24,30.86 39,30.86 39.38,31.24 39.38,32.13 40.4,33.15 v40.65,33.15
  Bottom 0.254: v26.17,31.5 28.84,28.83 33.03,28.83 33.66,29.46 v33.92,29.46 | IO9.P$1 46.92,33.02 46.8,33.15 v40.65,33.15
D10  (via drill 0.39)
  Top 0.254: IC1.30 26.41,32.4 27.06,31.75 27.06,31.37 27.19,31.24 28.08,31.24 28.33,30.99 28.33,30.35 28.97,29.72 v29.35,29.72 30.08,30.45 R22.5 | 43.02,40.51 IO10.P$1
  Bottom 0.254: IO10.P$1 42.36,39.5 32.78,39.5 32.14,38.86 32.14,37.66 31.76,37.27 31.76,35.56 34.55,32.77 34.55,31.37 32.9,29.72 v29.35,29.72
D11  (via drill 0.39)
  Top 0.254: IC1.12 21.93,40.69 v21.85,40.77
  Bottom 0.254: v21.85,40.77 21.85,39.5 21.35,38.99 18.68,38.99 17.92,39.75 v17.15,39.75
D12  (via drill 0.39)
  Top 0.254: IC1.26 24.41,32.59 23.7,31.88 v23.7,31.56 | v29.35,25.27 29.09,25.53 29.09,27.94 31,29.85 31,30.65 R22.6
  Bottom 0.254: v23.7,31.56 23.63,31.5 23.63,30.35 24.14,29.85 24.65,29.85 24.9,30.1 26.04,30.1 29.35,26.8 v29.35,25.27 28.33,25.27 26.43,23.37 26.43,19.81 26.81,19.43 28.97,19.43 37.93,10.47 IO12.P$1
D13  (via drill 0.39)
  Top 0.254: IC1.32 27.41,32.87 28.31,32.87 28.71,33.27 v28.71,33.78 | v31.31,43.69 31.31,44.6 R5.1
  Bottom 0.254: v28.71,33.78 28.71,37.34 28.97,37.59 31.12,37.59 31.63,38.1 31.63,43.37 v31.31,43.69
D+
  Top 0.254: R2.1 25.41,43.22 CN1.D+
D-
  Top 0.254: CN1.D- 26.06,44.18 26.55,43.69 28.42,43.69 R1.1
GND  (via drill 0.39)
  Top 0.254: IC1.5 25.91,38.86 | 25.91,38.86 25.91,37.71 25.41,37.21 | PWR.C arc90 19.23,48.13 CN1.SPRT@4 | CN1.SPRT@2 arc-90 22.23,45.45 CN1.GND 24.11,46.2 24.66,46.75 CN1.BASE@2 CN1.BASE@1 | IC1.15 24.28,38.08 | L.C 31.21,48.13 CN1.SPRT@3 | IC1.23 22.91,34.71 25.28,37.08 v25.41,37.08 | IC1.33 27.91,34.46 27.31,35.05 | 27.31,35.05 25.41,36.96 v25.41,37.08 | 27.31,35.05 28.85,35.05 IC1.35 29.7,35.08 29.85,34.93 31.34,34.93 31.97,34.29 C7.2 33.28,34.04 34.97,32.35 R7.1 | IC1.43 26.13,39.08 25.91,38.86 | v28.08,26.54 28.58,27.05 28.58,29.21 27.46,30.34 RESET.B' 26.84,30.39 26.43,29.97 26.43,28.83 25.98,28.39 24.96,28.39 24.39,28.96 24.39,29.59 23.59,30.39 RESET.B | 10.42,31.95 LED7.4 10.43,31.74 | 15.34,4.23 13.73,5.84 13.73,5.4 | 24.91,25.15 IC4.10 24.91,22.05 C3.2 | 24.91,25.15 25.91,25.15 | 25.91,25.15 IC4.12 | IC4.5 24.41,26.4 24.91,25.9 24.91,25.15 | 25.91,25.15 25.66,25.4 v25.41,25.4 | 24.28,38.08 24.54,38.08 25.41,37.21 | 24.28,38.08 v23.76,38.61 | 40.64,21.09 v40.4,21.34 40.23,21.5 C6.2 | Y1.2 18.04,38.48 v17.41,38.48 | 15.84,38.48 LED6.4 16.1,38.75 C2.2 | LED3.4 41.68,29.16 R13.1 | 33.78,40.38 v33.79,40.39 | 25.41,37.21 v25.41,37.08 | R4.1 13.31,32.26 12.71,32.85 v12.71,33.02 | R10.2 C9.2 | 34.67,16.68 34.63,16.64 | SWITCH.S1 27.91,20.03 27.95,20.07 | U1.3 34.3,18.15 v34.3,18.92 33.37,18.92 IC2.4
  Top 0.406: SWITCH.S2 27.91,17.27 | SWITCH.S1 27.91,17.27 | 27.91,17.27 v28.2,17.27 | LED8.4 9.14,23.56 Q1.2
  Top 0.61: LED8.4 9.14,24.53 v8.65,25.02 | C5.2 15.34,4.23 | C4.2 32.08,4.83 29.35,4.83 v27.82,6.35 26.66,7.51 BATT.1 26.41,8.3 C8.2 | v39.76,17.78 40.64,18.66 LED1.4 40.64,21.09 | v34.17,10.54 34.17,11.22 LED2.4 34.63,12.67 U1.2 | U1.3 34.63,16.64 U1.2 | LED3.4 41.68,25.89 v42.43,25.15 | 15.84,38.48 v17.41,38.48 | LED6.4 15.3,38.48 v14.11,38.48 | LED5.4 33.78,40.38 | LED4.4 37.94,35.56 v37.86,35.56 | U3.2 21.73,10.29 21.35,10.67 19.73,10.67 LED10.4 18.48,10.92 v18.04,10.92 | 10.43,31.74 v11.31,30.86 10.77,30.31 R14.1 | LED9.4 12.18,15.77 v11.31,16.64 | C9.2 35.9,16.47 U1.2
  Top 1.27: 13.73,5.4 GNDTAP2.P$1
  Bottom 0.254: v25.41,37.08 25.41,36.96 | v17.41,38.48 17.92,38.48 | 33.66,40.01 33.79,40.01 | 8.52,25.4 8.14,25.78 | v11.31,16.64 11.31,16.76 | v39.76,17.78 39.38,17.78 | v34.17,10.54 33.79,10.54 | v42.43,25.15 42.43,25.4 42.3,25.53 | v40.4,21.34 40.27,21.34 40.14,21.46 | 12.07,19.05 12.07,18.92 | 16.14,13.72 16.52,13.72 | v37.86,35.56 37.73,35.69
  Bottom 1.27: GNDTAP2.P$1 16.01,8.26 | GNDTAP.P$1 42.68,25.4 v42.43,25.15
  other vias: 25.41,48.26
  pour Bottom: 25.41,5.08 arc-90 5.09,25.4 arc-90 25.41,45.72 arc-90 45.73,25.4 arc-90
  pour Bottom: 14.74,50.8 14.61,44.07 35.44,44.07 35.57,50.8
LEFTBUTTON
  Top 0.254: IC1.25 23.91,32.85 23.31,32.26 22.74,32.26 22.49,32 22.49,28.83 22.23,28.58 21.35,28.58 20.81,28.04 20.33,28.04 SW1.A SW1.A' | 12,28.04 SW1.A' | R14.2 10.49,28.04 SW1.A'
MISO  (via drill 0.39)
  Top 0.254: IC1.11 22.91,41.24 22.23,41.91 v21.35,41.91 | v14.74,24.13 15.88,24.13 16.77,25.02 20.71,25.02 21.98,26.29 22.62,26.29 23.5,25.4 IC4.7
  Bottom 0.254: v21.35,41.91 19.06,41.91 TP1.P$1 16.77,43.18 15.69,42.1 15.69,25.08 v14.74,24.13
MOSI  (via drill 0.39)
  Top 0.254: IC1.10 23.41,41.62 22.62,42.42 21.98,42.42 21.22,43.18 v20.46,43.18 | v14.11,25.78 14.36,25.53 20.46,25.53 21.73,26.8 23.16,26.8 IC4.6
  Bottom 0.254: v20.46,43.18 TP4.P$1 18.93,44.58 17.28,44.58 15.06,42.35 15.06,26.73 v14.11,25.78
N$1
  Top 0.254: PWR.A arc-90 19.15,46.11 R3.1
N$2
  Top 0.254: IC2.2 31.67,20.77 R8.2 31.34,20.7 31.25,20.7 29.85,22.1 R9.2
N$3
  Top 0.254: IC1.3 26.91,41.07 27.4,41.57 R1.2
N$4
  Top 0.254: R2.2 27.57,42.8 27.57,42.41 26.41,41.25 IC1.4
N$6
  Top 0.254: C9.1 R10.1 37.22,19.47 IC2.5 38.49,19.47 R11.2
N$7
  Top 0.254: 24.52,6.73 24.52,7.4 BATT.2
  Top 0.61: D2.A 19.95,3.56 21.35,4.95 22.74,4.95 24.52,6.73
N$8
  Top 0.254: IC1.17 20.33,37.08 19.51,36.27 18.61,36.27 18.13,36.74 Y1.1
N$9
  Top 0.254: IC1.16 21.93,37.59 20.71,37.59 19.86,38.44 Y1.3
N$10
  Top 0.254: L.A 32.68,46.45 33.41,45.72 33.41,45 R5.2
N$11
  Top 0.254: LED1.1 38.89,13.55 LED2.3
N$12
  Top 0.254: LED1.3 42.16,21.99 41.67,22.48 41.67,23.38 LED3.1
N$13  (via drill 0.39)
  Top 0.254: LED2.1 32.15,10.42 32.15,10.91 v31.63,11.43 | v17.15,9.02 18,9.02 LED10.3
  Bottom 0.254: v17.15,9.02 20.46,9.02 21.85,10.41 30.62,10.41 v31.63,11.43
N$14
  Top 0.254: LED6.3 14.56,40.13 13.73,40.13 11.31,37.72 11.31,36.7 12.18,35.83 LED7.1
N$15
  Top 0.254: R8.1 29.77,19.35 30.74,18.38 C1.2
N$16
  Top 0.254: LED8.1 8.92,27.37 8.92,28.3 8.52,28.7 8.52,32.43 LED7.3
N$17
  Top 0.254: LED8.3 7.39,20.69 8.77,19.3 9.59,19.3 LED9.1
N$18
  Top 0.254: LED10.1 12.6,11.92 10.67,13.85 LED9.3
N$19
  Top 0.254: LED4.1 40.82,31.7 43.43,29.1 LED3.3
N$20
  Top 0.254: LED4.3 39.06,36.83 36.79,36.83 LED5.1
N$24
  Top 0.406: D4.A 18.68,20.7 14.92,16.94 SP1.+ 11.57,19.55 Q1.3
N$25
  Top 0.254: 20.24,23.84 R21.1 20.24,23.66 18.81,22.23 12.66,22.23 Q1.1
NEOPIX
  Top 0.254: LED6.1 18.93,40.84 18.93,42.8 20.33,44.2 23,44.2 24.41,42.78 IC1.8
RST  (via drill 0.39)
  Top 0.254: IC1.13 21.25,39.08 20.33,40.01 TP3.P$1 | 5.98,26.29 12.71,26.29 13.98,27.56 16.65,27.56 17.41,26.8 20.27,26.8 21.54,28.07 22.62,28.07 23.34,28.79 RESET.A 23.47,28.79 24.39,27.88 26.55,27.88 RESET.A'
  Top 0.406: 5.98,26.29 5.98,26.42 arc-55 14.87,41.66 16.39,41.66 v16.65,41.4
  Bottom 0.254: TP3.P$1 19.69,41.28 16.77,41.28 v16.65,41.4
  other vias: 20.33,40.64
SCK  (via drill 0.39)
  Top 0.254: IC1.9 23.91,42.14 TP2.P$1 | IC4.4 24.91,27.17 24.71,27.37 21.54,27.37 20.33,26.16 16.9,26.16 v16.65,26.42
  Bottom 0.254: 23.25,42.8 23,43.05 | 23,43.05 TP2.P$1 | 23,43.05 23,39.75 21.09,37.85 | 20.96,37.85 21.09,37.85 | 21.09,37.85 20.71,37.47 17.15,37.47 16.2,36.51 16.2,26.86 v16.65,26.42
  other vias: 22.87,43.18
SOUNDOUT
  Top 0.254: U1.1 32.24,16.68 C1.1
SPEAKER  (via drill 0.39)
  Top 0.254: IC1.31 26.91,32.66 27.53,32.04 v27.95,32.04 | v22.36,25.27 21.94,24.85 R21.2
  Bottom 0.254: v22.36,25.27 22.74,25.65 22.74,32.26 23.5,33.02 26.68,33.02 27.66,32.04 v27.95,32.04
TXLED  (via drill 0.39)
  Top 0.254: R22.4 R22.3 R22.2 R22.1 33.45,32.35 v33.66,32.13 | IC1.22 21.98,34.54 21.98,33.15 21.35,32.51 21.35,31.25 R15.4 R15.3 | R15.3 R15.2 R15.1 | v20.2,29.46 19.84,29.83 R15.3
  Bottom 0.254: v20.2,29.46 20.2,30.48 23.25,33.53 27.19,33.53 27.82,32.89 33.03,32.89 33.66,32.26 v33.66,32.13
VCC  (via drill 0.39)
  Top 0.254: C5.1 18.3,6.04
  Top 0.61: 20.78,8 20.78,6.87 D2.C 18.3,6.04 | 20.78,8 v21.98,8 22.68,8 U3.3 | D1.C 31.62,2.47 C4.1 35.44,3.5 36.97,5.02 VCC2.P$1 | 20.78,8 U3.1
  Bottom 0.61: v21.98,8 24.14,8 28.2,3.94 35.88,3.94 36.97,5.02 VCC2.P$1
VCC/2
  Top 0.254: IC2.3 IC2.6 IC2.7